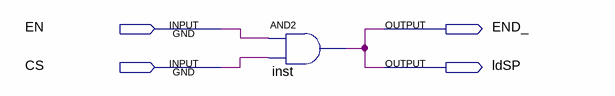
[diagram p0: schematic sheet]
// Quartus schematic TXS.bdf as structural Verilog: 1 symbols, 4 pins
module TXS (
  input  EN,
  input  CS,
  output END_,
  output ldSP
);

  and inst (END_, EN, CS);

  assign ldSP = END_;
endmodule
